# EAGLE design schematic (EAGLE 9.6.2)
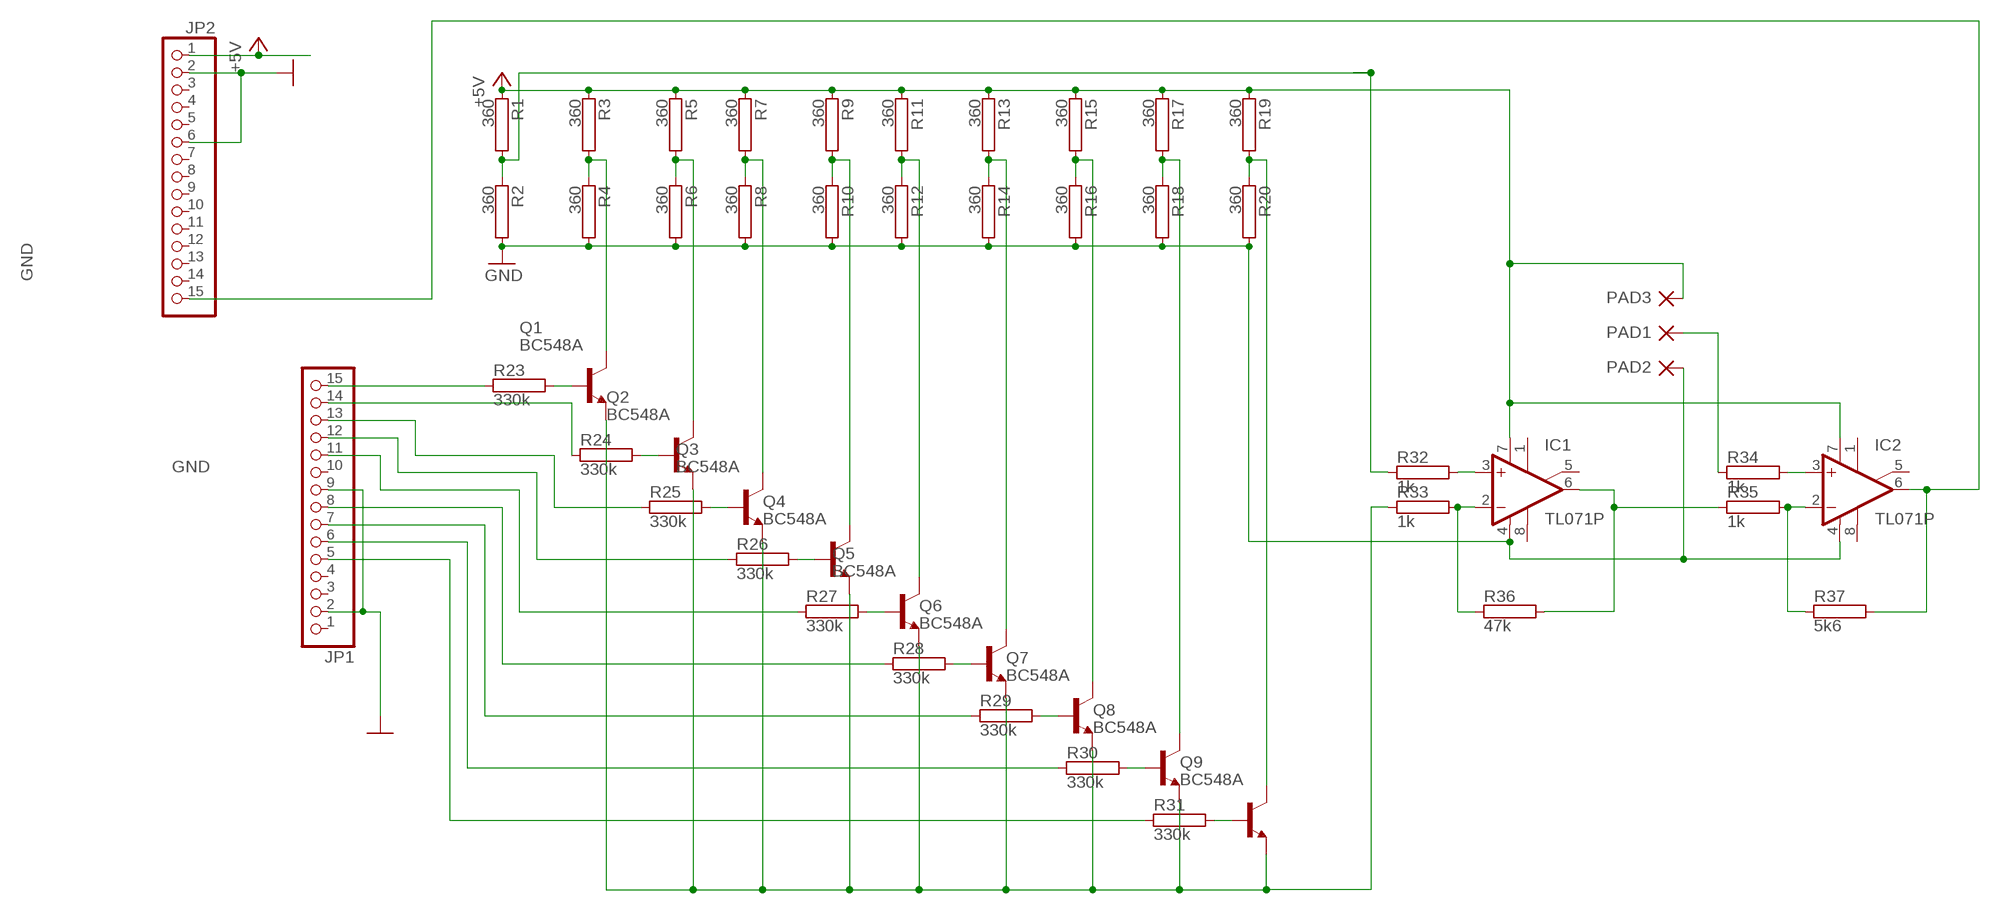
[diagram p0: schematic, sheet 1]

## Parts
IC1  TL071P  [DIL08]
IC2  TL071P  [DIL08]
JP1  PINHD-1X15  [1X15]
JP2  PINHD-1X15  [1X15]
PAD1  WIREPADSMD5-1,8  [5-1,8]
PAD2  WIREPADSMD5-1,8  [5-1,8]
PAD3  WIREPADSMD5-1,8  [5-1,8]
Q1  BC548A  [TO92-EBC]
Q2  BC548A  [TO92-EBC]
Q3  BC548A  [TO92-EBC]
Q4  BC548A  [TO92-EBC]
Q5  BC548A  [TO92-EBC]
Q6  BC548A  [TO92-EBC]
Q7  BC548A  [TO92-EBC]
Q8  BC548A  [TO92-EBC]
Q9  BC548A  [TO92-EBC]
R1  360  RRS1/4  [RS1/4]
R2  360  RRS1/4  [RS1/4]
R3  360  RRS1/4  [RS1/4]
R4  360  RRS1/4  [RS1/4]
R5  360  RRS1/4  [RS1/4]
R6  360  RRS1/4  [RS1/4]
R7  360  RRS1/4  [RS1/4]
R8  360  RRS1/4  [RS1/4]
R9  360  RRS1/4  [RS1/4]
R10  360  RRS1/4  [RS1/4]
R11  360  RRS1/4  [RS1/4]
R12  360  RRS1/4  [RS1/4]
R13  360  RRS1/4  [RS1/4]
R14  360  RRS1/4  [RS1/4]
R15  360  RRS1/4  [RS1/4]
R16  360  RRS1/4  [RS1/4]
R17  360  RRS1/4  [RS1/4]
R18  360  RRS1/4  [RS1/4]
R19  360  RRS1/4  [RS1/4]
R20  360  RRS1/4  [RS1/4]
R23  330k  RRS1/4  [RS1/4]
R24  330k  RRS1/4  [RS1/4]
R25  330k  RRS1/4  [RS1/4]
R26  330k  RRS1/4  [RS1/4]
R27  330k  RRS1/4  [RS1/4]
R28  330k  RRS1/4  [RS1/4]
R29  330k  RRS1/4  [RS1/4]
R30  330k  RRS1/4  [RS1/4]
R31  330k  RRS1/4  [RS1/4]
R32  1k  RRS1/4  [RS1/4]
R33  1k  RRS1/4  [RS1/4]
R34  1k  RRS1/4  [RS1/4]
R35  1k  RRS1/4  [RS1/4]
R36  47k  RRS1/4  [RS1/4]
R37  5k6  RRS1/4  [RS1/4]

## Nets
+5V: IC1.7(V+) IC2.7(V+) JP2.1 PAD3.1(P) R1.1 R3.1 R5.1 R7.1 R9.1 R11.1 R13.1 R15.1 R17.1 R19.1
GND: IC1.4(V-) IC2.4(V-) JP1.2 JP1.9 JP2.2 JP2.6 PAD2.1(P) R2.2 R4.2 R6.2 R8.2 R10.2 R12.2 R14.2 R16.2 R18.2 R20.2
N$1: R1.2 R2.1 R32.1
N$2: Q1.C R3.2 R4.1
N$3: Q2.C R5.2 R6.1
N$4: Q3.C R7.2 R8.1
N$5: Q4.C R9.2 R10.1
N$6: Q5.C R11.2 R12.1
N$7: Q6.C R13.2 R14.1
N$8: Q7.C R15.2 R16.1
N$9: Q8.C R17.2 R18.1
N$10: Q9.C R19.2 R20.1
N$11: Q1.B R23.2
N$12: JP1.15 R23.1
N$14: JP1.8 R28.1
N$15: Q2.B R24.2
N$16: JP1.11 R27.1
N$17: JP1.12 R26.1
N$18: Q3.B R25.2
N$19: JP1.14 R24.1
N$20: JP1.13 R25.1
N$21: Q4.B R26.2
N$22: Q1.E Q2.E Q3.E Q4.E Q5.E Q6.E Q7.E Q8.E Q9.E R33.1
N$23: IC1.6(OUT) R35.1 R36.2
N$24: Q5.B R27.2
N$25: IC1.3(+IN) R32.2
N$26: IC2.3(+IN) R34.2
N$27: Q6.B R28.2
N$28: IC2.6(OUT) JP2.15 R37.2
N$29: IC2.2(-IN) R35.2 R37.1
N$30: Q7.B R29.2
N$31: JP1.7 R29.1
N$32: PAD1.1(P) R34.1
N$33: Q8.B R30.2
N$34: JP1.6 R30.1
N$35: IC1.2(-IN) R33.2 R36.1
N$36: Q9.B R31.2
N$37: JP1.5 R31.1
Unconnected: IC1.1(ON1) IC1.5(ON2) IC1.8(OPT) IC2.1(ON1) IC2.5(ON2) IC2.8(OPT) JP1.1 JP1.3 JP1.4 JP1.10 JP2.3 JP2.4 JP2.5 JP2.7 JP2.8 JP2.9 JP2.10 JP2.11 JP2.12 JP2.13 JP2.14

## Library data of the parts
IC1 IC2 = linear:TL071: OP AMP
JP1 JP2 = pinhead:PINHD-1X15: PIN HEADER
PAD1-PAD3 = wirepad:WIREPAD: Wire PAD connect wire on PCB
Q1-Q9 = transistor-npn:BC548*: NPN Transistor
R1-R20 R23-R37 = resistor-power:R: Power Resitor; MF: OHMITE; MPN: RRS1K0; OC_FARNELL: unknown; OC_NEWARK: 01F7661

## Board
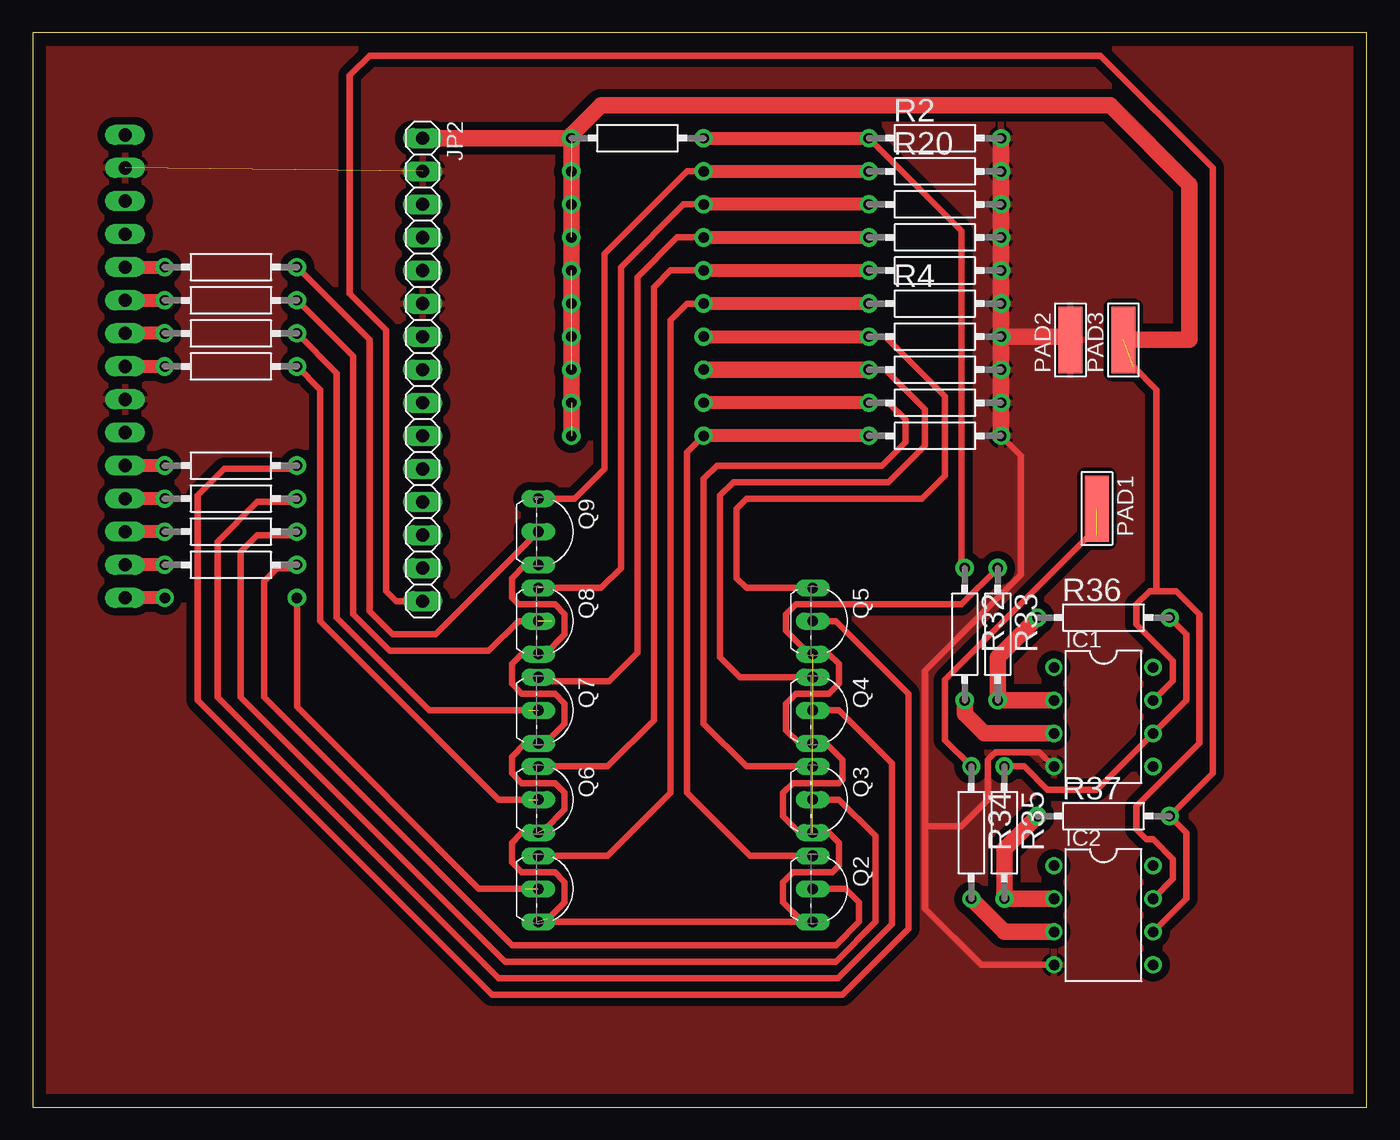
[diagram p1: board, top side]
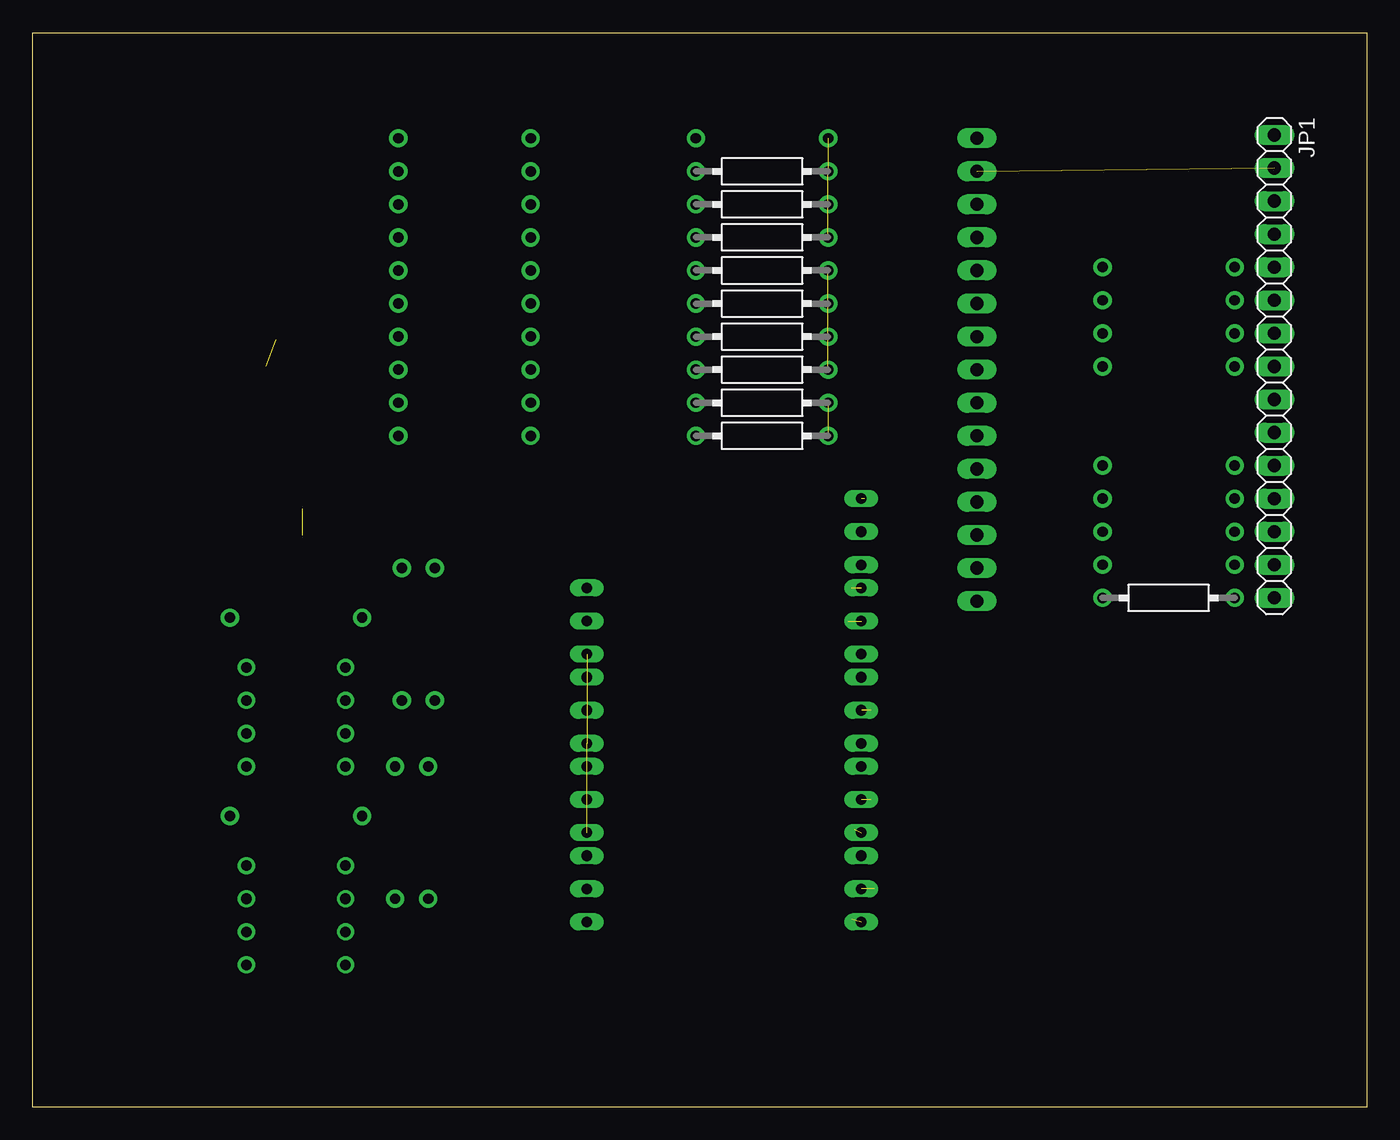
[diagram p2: board, bottom side, seen from below]

Size 102.54 x 82.54 mm. Coordinates in mm from the lower left corner, seen from the top.
Outline: 0,0 102.54,0 102.54,82.54 0,82.54 0,0
Copper layers (1*16): Top 0.035mm / dielectric 1.5mm / Bottom 0.035mm
Design rules "default": minimum track width 6mil, minimum drill 0.35mm, track to track 6mil, track to pad 6mil, pad to pad 6mil, via to via 6mil, smd to smd 6mil, copper to edge 40mil, drill to drill 6mil, minimum pad ring 10mil, minimum via ring 8mil, stop-mask expansion 4mil, vias tented up to drill 0mil, thermal gap 10mil

### Footprints (pad centres in the part's own frame; a part is rotated, then mirrored left to right if it is on the bottom)
DIL08 = drill 0.813 pad 1.27: 1 -3.81,-3.81; 2 -1.27,-3.81; 3 1.27,-3.81; 4 3.81,-3.81; 5 3.81,3.81; 6 1.27,3.81; 7 -1.27,3.81; 8 -3.81,3.81
1X15 = drill 1.016 long: 1 -17.78,0; 2 -15.24,0; 3 -12.7,0; 4 -10.16,0; 5 -7.62,0; 6 -5.08,0; 7 -2.54,0; 8 0,0; 9 2.54,0; 10 5.08,0; 11 7.62,0; 12 10.16,0; 13 12.7,0; 14 15.24,0; 15 17.78,0
5-1,8 = smd 1.829 x 5.08: 1 0,0
TO92-EBC = drill 0.813 long: B 0,-1.27; C -2.54,-1.27; E 2.54,-1.27
RS1/4 = drill 0.8 pad 1.4: 1 -5.08,0; 2 5.08,0

### Placement (x,y rotation side)
IC1  82.3,29.97 270 top
IC2  82.3,14.73 270 top
JP1  7.11,56.9 270 bottom
JP2  29.97,56.64 270 top
PAD1  81.79,45.97 180 top
PAD2  79.76,58.93 0 top
PAD3  83.82,58.93 0 top
Q1  40.13,16.76 270 top
Q2  61.21,16.76 270 top
Q3  61.21,23.62 270 top
Q4  61.21,30.48 270 top
Q5  61.21,37.34 270 top
Q6  40.13,23.62 270 top
Q7  40.13,30.48 270 top
Q8  40.13,37.34 270 top
Q9  40.13,44.2 270 top
R1  46.48,74.42 0 top
R2  69.34,74.42 0 top
R3  46.48,61.72 180 bottom
R4  69.34,61.72 0 top
R5  46.48,51.56 180 bottom
R6  69.34,51.56 0 top
R7  46.48,54.1 180 bottom
R8  69.34,54.1 0 top
R9  46.48,56.64 180 bottom
R10  69.34,56.64 0 top
R11  46.48,59.18 180 bottom
R12  69.34,59.18 0 top
R13  46.48,64.26 180 bottom
R14  69.34,64.26 0 top
R15  46.48,66.8 180 bottom
R16  69.34,66.8 0 top
R17  46.48,69.34 180 bottom
R18  69.34,69.34 0 top
R19  46.48,71.88 180 bottom
R20  69.34,71.88 0 top
R23  15.24,39.12 180 bottom
R24  15.24,41.66 0 top
R25  15.24,44.2 0 top
R26  15.24,46.74 0 top
R27  15.24,49.28 0 top
R28  15.24,56.9 0 top
R29  15.24,59.44 0 top
R30  15.24,61.98 0 top
R31  15.24,64.52 0 top
R32  71.63,36.32 270 top
R33  74.17,36.32 270 top
R34  72.14,21.08 270 top
R35  74.68,21.08 270 top
R36  82.3,37.59 0 top
R37  82.3,22.35 0 top

### Tracks (layer width: path | path; a pad name or v marks a point on that pad's centre or on a via)
+5V  (8 unrouted)
  Top 0.508: IC2.7 87.63,17.53 87.63,19.05 86.11,20.57 85.6,20.57 84.84,21.34 84.84,23.11 89.66,27.94 89.66,37.85 87.88,39.62 86.36,39.62 | IC1.7 87.63,32.77 87.63,34.29 84.84,37.08 84.84,38.61 85.85,39.62 86.36,39.62 | 86.36,39.62 86.36,55.12 84.58,56.9
  Top 1.27: R1.1 JP2.1 | R1.1 R13.1 R5.1 | R1.1 41.4,74.68 43.69,76.96 82.8,76.96 88.9,70.87 88.9,58.93 PAD3.1
GND  (1 unrouted)
  Top 0.508: IC2.4 72.9,10.92 68.58,15.24 68.58,21.59 | 68.58,21.59 68.58,33.53 75.95,40.89 75.95,50.04 R6.2 | 68.58,21.59 71.37,21.59 73.41,23.62 73.41,26.67 74,27.27 77.38,27.27 IC1.4
  Top 1.27: R2.2 R14.2 R6.2 | R12.2 79.5,59.18 PAD2.1
  pour Top (isolate 0.61, rank 5): 0,-5.08 2.54,-2.54 106.68,-2.54 106.68,88.9 -2.54,88.9 -5.08,86.36 -5.08,0
N$1
  Top 0.508: R2.1 71.37,67.31 71.37,41.66 R32.1
  Top 1.016: R1.2 R2.1
N$2
  Top 0.508: R3.2 50.29,61.72 49.02,60.45 49.02,24.13 44.2,19.3 Q1.C
  Top 1.016: R4.1 R3.2
N$3
  Top 0.508: Q2.C 55.12,19.3 50.29,24.13 50.29,50.29 R5.2
  Top 1.016: R6.1 R5.2
N$4
  Top 0.508: Q3.C 54.86,26.16 51.56,29.46 51.56,48.26 52.58,49.28 65.28,49.28 67.06,51.05 67.06,52.83 65.79,54.1 R8.1
  Top 1.016: R8.1 R7.2
N$5
  Top 0.508: Q4.C 54.36,33.02 52.83,34.54 52.83,46.99 53.85,48.01 65.79,48.01 68.58,50.8 68.58,53.59 65.53,56.64 R10.1
  Top 1.27: R9.2 R10.1
N$6
  Top 0.508: Q5.C 54.86,39.88 54.1,40.64 54.1,45.97 54.86,46.74 68.33,46.74 70.1,48.51 70.1,54.61 65.53,59.18 R12.1
  Top 1.016: R11.2 R12.1
N$7
  Top 0.508: R13.2 49.02,64.26 47.75,62.99 47.75,29.72 44.2,26.16 Q6.C
  Top 1.016: R13.2 R14.1
N$8
  Top 0.508: Q7.C 39.17,32.72 44.28,32.72 46.48,34.91 46.48,63.75 49.53,66.8 R15.2
  Top 1.016: R15.2 R16.1
N$9  (1 unrouted)
  Top 0.508: 39.62,39.88 43.69,39.88 45.21,41.4 45.21,64.52 50.04,69.34 R17.2
  Top 1.016: R18.1 R17.2
N$10  (1 unrouted)
  Top 0.508: R19.2 50.29,71.88 43.94,65.53 43.94,49.02 41.66,46.74 38.61,46.74
  Top 1.016: R19.2 R20.1
N$11  (1 unrouted)
  Top 0.508: R23.2 20.32,30.73 34.29,16.76 37.85,16.76
N$12
  Top 1.016: R23.1 JP1.15
N$14
  Top 1.016: JP1.8 R28.1
N$15
  Top 0.508: R24.2 20.07,41.4 18.8,41.4 17.78,40.39 17.78,31.5 36.83,12.45 61.72,12.45 63.5,14.22 63.5,15.75 62.48,16.76 Q2.B
N$16
  Top 1.016: R27.1 JP1.11
N$17
  Top 1.016: R26.1 JP1.12
N$18
  Top 0.508: R25.2 20.07,43.94 17.27,43.94 16,42.67 16,31.5 36.32,11.18 61.72,11.18 64.77,14.22 64.77,20.83 61.98,23.62 Q3.B
N$19
  Top 1.016: R24.1 JP1.14
N$20
  Top 1.016: R25.1 JP1.13
N$21
  Top 0.508: R26.2 20.07,46.48 17.27,46.48 14.22,43.43 14.22,31.5 35.81,9.91 61.89,9.91 66.04,14.05 66.04,26.42 61.98,30.48 Q4.B
N$22  (4 unrouted)
  Top 0.508: 39.12,41.4 Q9.E 37.85,41.66 36.83,40.64 36.83,39.12 37.34,38.61 40.13,38.61 40.89,37.85 40.89,36.32 39.37,34.8 Q8.E 37.59,34.8 36.83,34.04 36.83,32.51 37.59,31.75 40.13,31.75 40.89,30.99 40.89,29.46 39.37,27.94 Q7.E 37.85,27.94 36.83,26.92 36.83,25.65 37.59,24.89 40.13,24.89 40.89,24.13 40.89,22.86 39.37,21.34 | Q6.E 37.59,21.08 36.83,20.32 36.83,18.8 37.59,18.03 40.13,18.03 40.89,17.27 40.89,15.75 39.62,14.48 | Q1.E 59.18,14.22 | 59.18,14.22 Q2.E | 59.18,14.22 57.66,15.75 57.66,17.27 58.42,18.03 61.47,18.03 61.98,18.54 61.98,20.32 61.21,21.08 58.93,21.08 57.66,22.35 57.66,24.13 58.42,24.89 61.98,24.89 62.23,25.15 62.23,26.67 60.96,27.94 58.93,27.94 57.91,28.96 57.91,30.99 58.67,31.75 61.21,31.75 61.98,32.51 61.98,34.04 61.21,34.8 Q5.E 59.69,34.8 57.91,36.58 57.91,37.85 58.67,38.61 71.37,38.61 R33.1 74.13,41.4
N$23
  Top 0.508: R36.2 88.65,36.32 88.65,31.24 IC1.6 81.79,24.38 77.98,24.38 76.2,26.16 R35.1
N$24
  Top 0.508: R27.2 20.07,49.02 14.73,49.02 12.7,46.99 12.7,31.24 35.31,8.64 62.23,8.64 67.31,13.72 67.31,31.75 61.72,37.34 Q5.B
N$25
  Top 1.27: IC1.3 73.15,28.7 71.63,30.23 R32.2
N$26
  Top 1.27: IC2.3 74.68,13.46 R34.2
N$27  (1 unrouted)
  Top 0.508: R28.2 22.1,55.12 22.1,37.34 35.81,23.62 38.1,23.62
N$28
  Top 0.508: 30.99,38.86 JP2.15 27.94,38.86 27.18,39.62 27.18,59.69 24.38,62.48 24.38,79.25 25.91,80.77 82.04,80.77 90.68,72.14 90.68,25.65 R37.2 88.65,21.08 88.65,16 IC2.6
N$29
  Top 1.27: IC2.2 R35.2 74.68,19.81 R37.1
N$30  (1 unrouted)
  Top 0.508: R29.2 23.37,56.39 23.37,37.59 30.48,30.48 38.1,30.48
N$31
  Top 1.016: R29.1 JP1.7
N$32  (1 unrouted)
  Top 0.508: R34.1 70.1,28.19 70.1,32.82 81.22,43.94 81.79,43.94
N$33  (1 unrouted)
  Top 0.508: R30.2 24.64,57.66 24.64,37.85 27.43,35.05 35.05,35.05 37.34,37.34 39.88,37.34
N$34
  Top 1.016: JP1.6 R30.1
N$35
  Top 1.27: IC1.2 R33.2 74.17,34.54 R36.1
N$36
  Top 0.508: R31.2 25.91,58.93 25.91,38.1 27.69,36.32 30.99,36.32 Q9.B
N$37
  Top 1.016: JP1.5 R31.1